# Altium project TeensyControls.PrjPcb
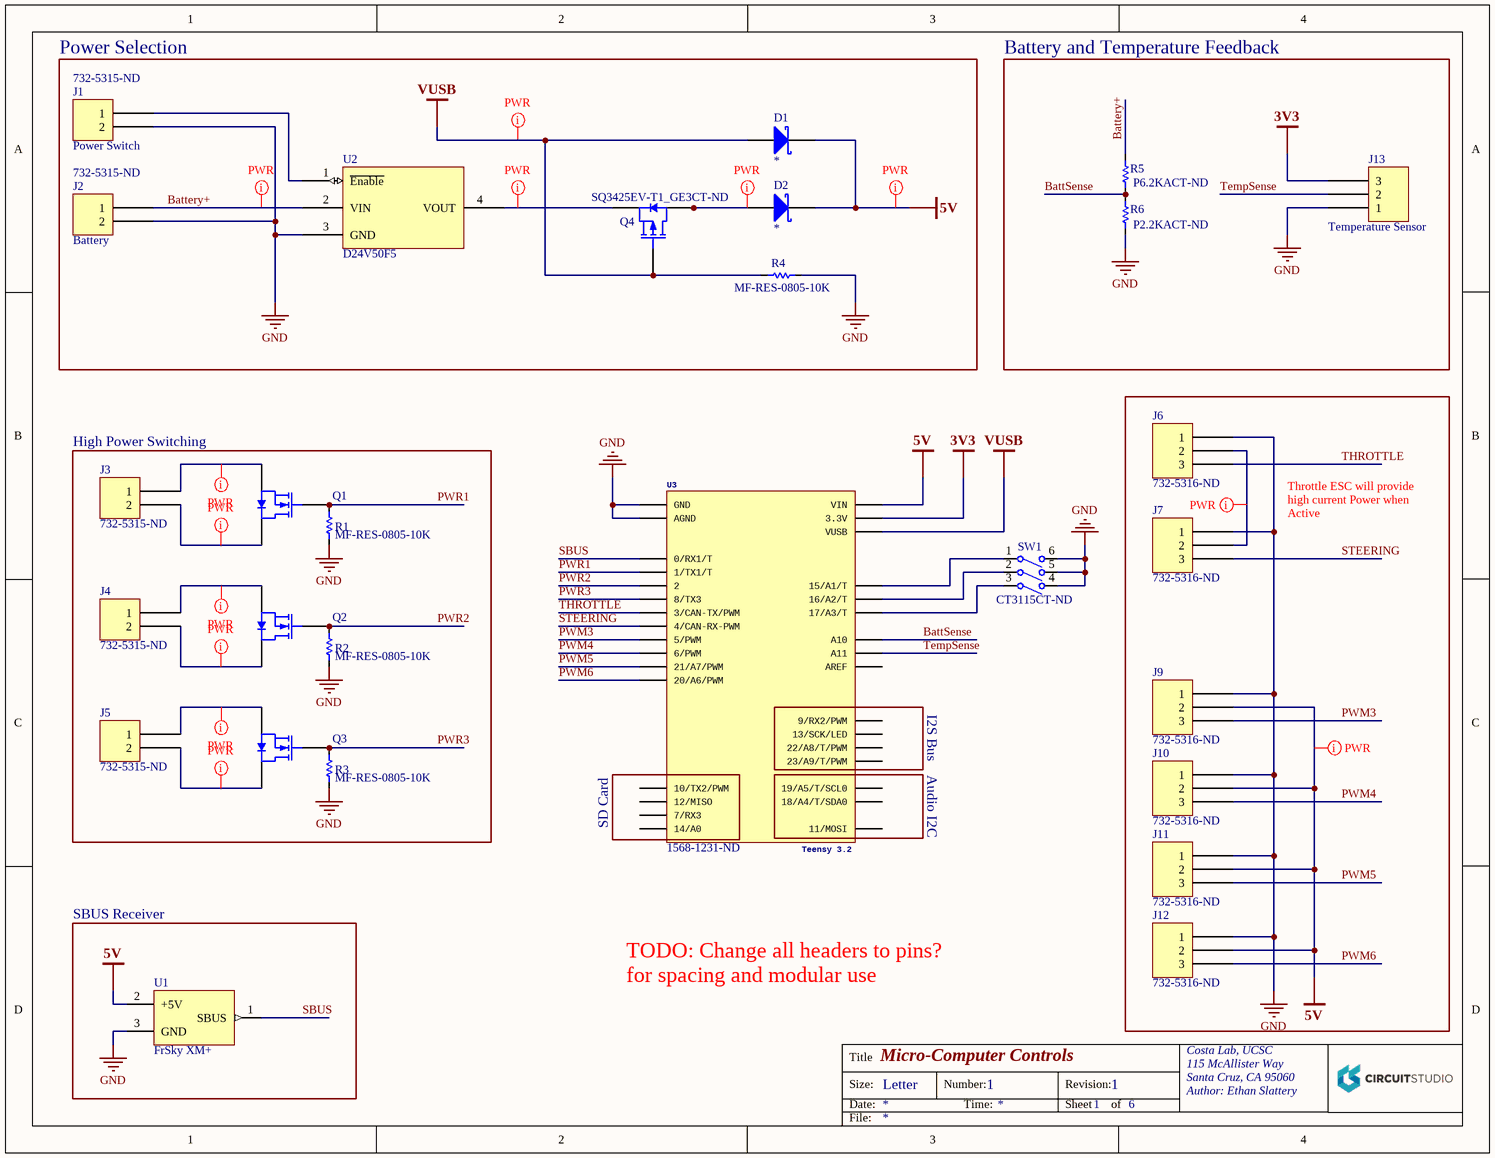
[diagram p0: Teensy32.SchDoc]
Address1: 115 McAllister Way; Address2: Santa Cruz, CA 95060; Address3: Author: Ethan Slattery; Author: Ethan Slattery; Organization: Costa Lab, UCSC
1 sheet, 28 parts. Net scope: global (net labels, ports and power ports of the same name join across sheets).

## Sheet Teensy32.SchDoc: Micro-Computer Controls
size Letter; Organization: Costa Lab, UCSC; Address1: 115 McAllister Way; Address2: Santa Cruz, CA 95060; Address3: Author: Ethan Slattery; DocumentNumber: 1; Revision: 1; SheetNumber: 1; SheetTotal: 6

### Parts
D1  *
D2  *
J1  Power Switch  Supplier Part Number 1: 732-5315-ND  [Pinhead_1x2]
J2  Battery  Supplier Part Number 1: 732-5315-ND  [Pinhead_1x2]
J3  732-5315-ND  [Pinhead_1x2]
J4  732-5315-ND  [Pinhead_1x2]
J5  732-5315-ND  [Pinhead_1x2]
J6  Supplier Part Number 1: 732-5316-ND  [Pinhead_1x3]  (hidden comment: Header)
J7  Supplier Part Number 1: 732-5316-ND  [Pinhead_1x3]  (hidden comment: Header)
J9  Supplier Part Number 1: 732-5316-ND  [Pinhead_1x3]  (hidden comment: Header)
J10  Supplier Part Number 1: 732-5316-ND  [Pinhead_1x3]  (hidden comment: Header)
J11  Supplier Part Number 1: 732-5316-ND  [Pinhead_1x3]  (hidden comment: Header)
J12  Supplier Part Number 1: 732-5316-ND  [Pinhead_1x3]  (hidden comment: Header)
J13  Temperature Sensor  [Pinhead_1x3]
Q1  MOSFET N-Ch  [TO-220]  (value not drawn)
Q2  MOSFET N-Ch  [TO-220]  (value not drawn)
Q3  MOSFET N-Ch  [TO-220]  (value not drawn)
Q4  SQ3425EV-T1_GE3CT-ND  [TSOP-6_L]
R1  MF-RES-0805-10K  [R0805N]
R2  MF-RES-0805-10K  [R0805N]
R3  MF-RES-0805-10K  [R0805N]
R4  MF-RES-0805-10K  [R0805N]
R5  P6.2KACT-ND  [R0805L]
R6  P2.2KACT-ND  [R0805L]
SW1  CT3115CT-ND  [CTS-219-3]
U1  FrSky XM+  [FrSky XM+ (Vert Mount)]
U2  D24V50F5  [D24V50Fx]
U3  Teensy 3.2  Supplier Part Number 1: 1568-1231-ND  [TEENSY_3.0-3.2&LC_SMD+4]

### Blocks framed on the sheet
Power Selection: D1 D2 J1 J2 Q4 R4 U2
Battery and Temperature Feedback: J13 R5 R6
High Power Switching: J3-J5 Q1-Q3 R1-R3
SBUS Receiver: U1

### Nets
3V3: J13.3 U3.3.3V
5V: D1.2(K) D2.2(K) J9.2 J10.2 J11.2 J12.2 U1.2(+5V) U3.VIN
GND: J1.2 J2.2 J6.1 J7.1 J9.1 J10.1 J11.1 J12.1 J13.1 R1.2 R2.2 R3.2 R4.2 R6.1 SW1.4(B3) SW1.5(B2) SW1.6(B1) U1.3(GND) U2.3(GND) U3.AGND U3.GND
VUSB: D1.1(A) Q4.3(G) R4.1 U3.VUSB
Battery+: J2.1 R5.2 U2.2(VIN)
BattSense: R5.1 R6.2 U3.A10
PWM3: J9.3 U3.5(5/PWM)
PWM4: J10.3 U3.6(6/PWM)
PWM5: J11.3 U3.21/A7(21/A7/PWM)
PWM6: J12.3 U3.20/A6(20/A6/PWM)
PWR1: Q1.1(G) R1.1 U3.1(1/TX1/T)
PWR2: Q2.1(G) R2.1 U3.2
PWR3: Q3.1(G) R3.1 U3.8(8/TX3)
SBUS: U1.1(SBUS) U3.0(0/RX1/T)
STEERING: J7.3 U3.4(4/CAN-RX-PWM)
TempSense: J13.2 U3.A11
THROTTLE: J6.3 U3.3(3/CAN-TX/PWM)
NetD2_1: D2.1(A) Q4.1(D) Q4.2(D) Q4.5(D) Q4.6(D)
NetJ1_1: J1.1 U2.1(~{Enable})
NetJ3_1: J3.1 Q1.3(S)
NetJ3_2: J3.2 Q1.2(D)
NetJ4_1: J4.1 Q2.3(S)
NetJ4_2: J4.2 Q2.2(D)
NetJ5_1: J5.1 Q3.3(S)
NetJ5_2: J5.2 Q3.2(D)
NetJ6_2: J6.2 J7.2
NetQ4_4: Q4.4(S) U2.4(VOUT)
NetSW1_1: SW1.1(A1) U3.15/A1(15/A1/T)
NetSW1_2: SW1.2(A2) U3.16/A2(16/A2/T)
NetSW1_3: SW1.3(A3) U3.17/A3(17/A3/T)

Not connected (* = marked no-connect by the designer): U3 7(7/RX3) 9(9/RX2/PWM) 10(10/TX2/PWM) 11(11/MOSI) 12(12/MISO) 13(13/SCK/LED) 14/A0 18/A4(18/A4/T/SDA0) 19/A5(19/A5/T/SCL0) 22/A8(22/A8/T/PWM) 23/A9(23/A9/T/PWM) AREF

### Layout directives
net class PWR: 5V, Battery+, NetD2_1, NetJ3_1, NetJ3_2, NetJ4_1, NetJ4_2, NetJ5_1, NetJ5_2, NetJ6_2, NetQ4_4, VUSB

### Notes on the sheet
- Throttle ESC will provide high current Power when Active
- I2S Bus
- Audio I2C
- SD Card
- TODO: Change all headers to pins? for spacing and modular use
- Title
- Size:
- Date:
- Letter
- Number:
- Time:
- Revision:
- Sheet
- of
- File:

### Library data of the parts
D1 D2 = Schottky Diode: POPULATE: 1; HOUSEPART: *; MPN: *; URL: *; MF_PARTNUM: *; Forward Voltage Drop: *; Temperature Range: *; Leakage Current (Ir): *; Surge Current: *; Peak Current: *; Peak Reverse Voltage: *
J1-J5 = 2 Pin: Supplier 1: Digi-Key
  J3-J5: Supplier Part Number 1: 732-5315-ND
J6 J7 J9-J13 = 3 Pin: Supplier 1: Digi-Key
  J13: Supplier Part Number 1: 732-5316-ND
Q4 = MOSFET P-CH SOT26 / SOP-6: HOUSEPART: NO; POPULATE: YES; Continous Drain Current (Id): 7.4A; Drain-Source Voltage (Vds): 20V; Gate-Source Votlage (Vgs): 12V; Power Dissapation (Pd): 5W; MF_PARTNUM: SQ3425EV-T1_GE3CT-ND; MPN: SQ3425EV; Mounting Technology: SMD; Package Description: TSOP-6; Supplier 1: Digi-Key; Supplier Part Number 1: SQ3425EV-T1_GE3CT-ND
R1-R4 = RESISTOR: HOUSEPART: YES; POPULATE: 1; TOLERANCE: 5%; VOLTAGE: 150V; WATTAGE: 125mW; VALUE: 10K; SymbolName_1: RESISTOR; LibraryName: MF_Passives; DeviceSetName: RESISTOR; MF_PARTNUM: MF-RES-0805-10K; Supplier 1: Digi-Key; Supplier Part Number 1: P10KACT-ND
R5 = RESISTOR: POPULATE: 1; Value: 6.2K; SymbolName_1: RESISTOR; LibraryName: MF_Passives; DeviceSetName: RESISTOR; Supplier 1: Digi-Key; Supplier Part Number 1: P6.2KACT-ND
R6 = RESISTOR: POPULATE: 1; VALUE: 2.2K; SymbolName_1: RESISTOR; LibraryName: MF_Passives; DeviceSetName: RESISTOR; Supplier 1: Digi-Key; Supplier Part Number 1: P2.2KACT-ND
SW1 = SPST 3-position: Supplier 1: Digi-Key; Supplier Part Number 1: CT3115CT-ND
U1 = FrSky XM+ Radio: FrSky 2.4GHz 16CH SBUS receiver
U2 = D24V25Fx: DC Step Down Regulators from Pololu; Current: 5A; Voltage - Min: 38V; Voltage - Max: 6V; Voltage - Output: 5V; Reverse Voltage Protection: YES; Maximum quiescent current: .8mA; POPULATE: 0; Name: D24V50F5; URL: https://www.pololu.com/product/2851
U3 = TEENSY 3.2 + 4: Teensy 3.2 /w 4 inner pins; Processor: MK20DX256VLH7; Clock Speed: 72MHz; Flash: 256 kb; RAM: 64 kb; DMA Channels: 4; USB: Yes; ADCs: 2; DeviceName: Teensy 3.2; URL: https://www.pjrc.com/teensy/teensy31.html; Supplier 1: Digi-Key
Q1-Q3 = MOSFET N-Ch: MF_PARTNUM: *; HOUSEPART: *; POPULATE: *; MPN: *; Mounting Technology: *; Package Description: *; Continous Drain Current (Id): *; Drain-Source Voltage (Vds): *; Gate-Source Votlage (Vgs): *; Power Dissapation (Pd): *; Supplier 1: Digi-Key; Supplier Part Number 1: FQP30N06L-ND